# Altium schematic sheet hdmi.SchDoc
size A4
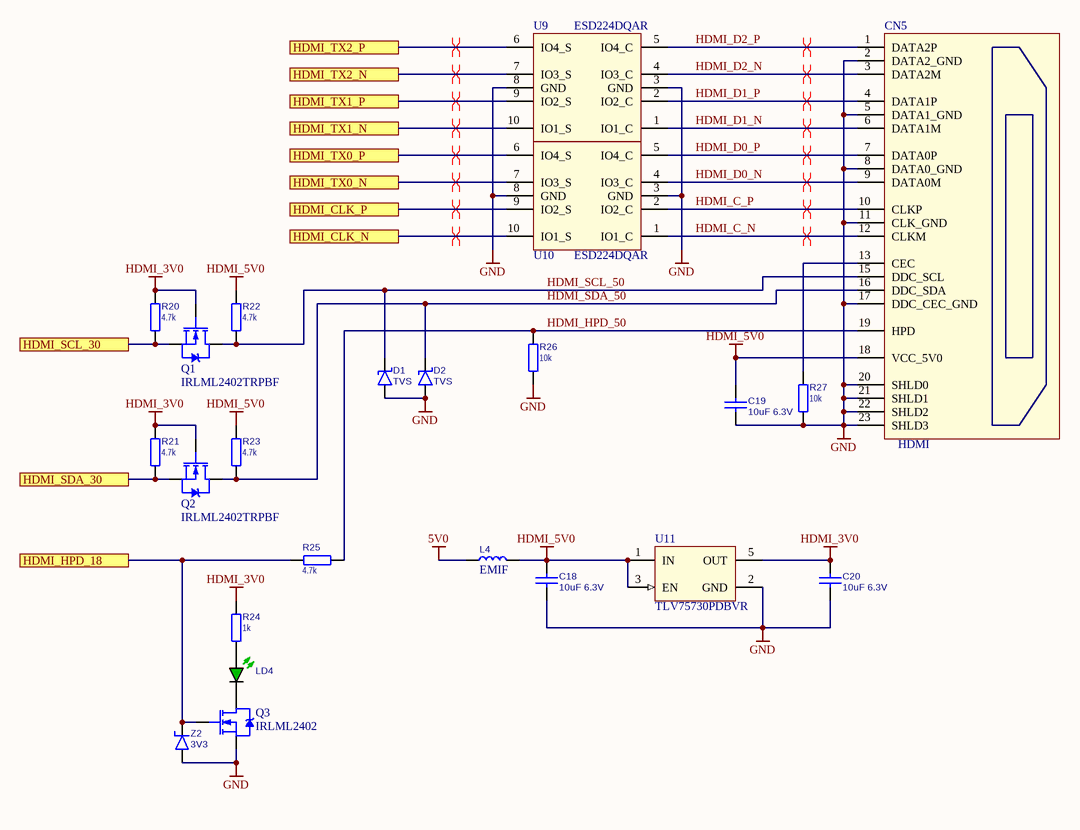
[diagram p0: hdmi.SchDoc]

## Parts
C18  value 10uF 6.3V  [C0603]  (hidden comment: CC0603MRX5R5BB106)
C19  value 10uF 6.3V  [C0603]  (hidden comment: CC0603MRX5R5BB106)
C20  value 10uF 6.3V  [C0603]  (hidden comment: CC0603MRX5R5BB106)
CN5  value HDMI  [1747981-1]  (hidden comment: KLS1-285-19-22-N1B)
D1  value TVS  [SOD-323]  (hidden comment: CDSOD323-T05LC)
D2  value TVS  [SOD-323]  (hidden comment: CDSOD323-T05LC)
L4  value EMIF  [IND0805]  (hidden comment: BLM21PG221SN1D)
LD4  LED_G  [LED0805]  (value not drawn)
Q1  IRLML2402TRPBF  [SOT-23-3]
Q2  IRLML2402TRPBF  [SOT-23-3]
Q3  IRLML2402  [SOT-23-3]
R20  4.7k  [R0603]
R21  4.7k  [R0603]
R22  4.7k  [R0603]
R23  4.7k  [R0603]
R24  1k  [R0603]
R25  4.7k  [R0603]
R26  10k  [R0603]
R27  10k  [R0603]
U9  ESD224DQAR  [USON-10]
U10  ESD224DQAR  [USON-10]
U11  TLV75730PDBVR  [SOT-23-5]
Z2  value 3V3  [SOD-80C]  (hidden comment: BZV55-C3V3.115)

## Ports
HDMI_CLK_N, HDMI_CLK_P, HDMI_HPD_18, HDMI_SCL_30, HDMI_SDA_30, HDMI_TX0_N, HDMI_TX0_P, HDMI_TX1_N, HDMI_TX1_P, HDMI_TX2_N, HDMI_TX2_P

## Nets
5V0: L4.2
GND: C18.2 C19.2 C20.2 CN5.2(DATA2_GND) CN5.5(DATA1_GND) CN5.8(DATA0_GND) CN5.11(CLK_GND) CN5.17(DDC_CEC_GND) CN5.20(SHLD0) CN5.21(SHLD1) CN5.22(SHLD2) CN5.23(SHLD3) D1.1(A) D2.1(A) Q3.2(S) R26.1 R27.1 U9.3(GND) U9.8(GND) U10.3(GND) U10.8(GND) U11.2(GND) Z2.1(A)
HDMI_3V0: C20.1 Q1.1(G) Q2.1(G) R20.2 R21.2 R24.2 U11.5(OUT)
HDMI_5V0: C18.1 C19.1 CN5.18(VCC_5V0) L4.1 R22.2 R23.2 U11.1(IN) U11.3(EN)
HDMI_C_N: CN5.12(CLKM) U10.1(IO1_C)
HDMI_C_P: CN5.10(CLKP) U10.2(IO2_C)
HDMI_CLK_N: U10.10(IO1_S) ; port HDMI_CLK_N
HDMI_CLK_P: U10.9(IO2_S) ; port HDMI_CLK_P
HDMI_D0_N: CN5.9(DATA0M) U10.4(IO3_C)
HDMI_D0_P: CN5.7(DATA0P) U10.5(IO4_C)
HDMI_D1_N: CN5.6(DATA1M) U9.1(IO1_C)
HDMI_D1_P: CN5.4(DATA1P) U9.2(IO2_C)
HDMI_D2_N: CN5.3(DATA2M) U9.4(IO3_C)
HDMI_D2_P: CN5.1(DATA2P) U9.5(IO4_C)
HDMI_HPD_18: Q3.1(G) R25.1 Z2.2(K) ; port HDMI_HPD_18
HDMI_HPD_50: CN5.19(HPD) R25.2 R26.2
HDMI_SCL_30: Q1.2(S) R20.1 ; port HDMI_SCL_30
HDMI_SCL_50: CN5.15(DDC_SCL) D1.2(K) Q1.3(D) R22.1
HDMI_SDA_30: Q2.2(S) R21.1 ; port HDMI_SDA_30
HDMI_SDA_50: CN5.16(DDC_SDA) D2.2(K) Q2.3(D) R23.1
HDMI_TX0_N: U10.7(IO3_S) ; port HDMI_TX0_N
HDMI_TX0_P: U10.6(IO4_S) ; port HDMI_TX0_P
HDMI_TX1_N: U9.10(IO1_S) ; port HDMI_TX1_N
HDMI_TX1_P: U9.9(IO2_S) ; port HDMI_TX1_P
HDMI_TX2_N: U9.7(IO3_S) ; port HDMI_TX2_N
HDMI_TX2_P: U9.6(IO4_S) ; port HDMI_TX2_P
NetCN5_13: CN5.13(CEC) R27.2
NetLD4_1: LD4.1 Q3.3(D)
NetLD4_2: LD4.2 R24.1

## Layout directives
differential pair: HDMI_C_N, HDMI_C_P, HDMI_CLK_N, HDMI_CLK_P, HDMI_D0_N, HDMI_D0_P, HDMI_D1_N, HDMI_D1_P, HDMI_D2_N, HDMI_D2_P, HDMI_TX0_N, HDMI_TX0_P, HDMI_TX1_N, HDMI_TX1_P, HDMI_TX2_N, HDMI_TX2_P

## Library data of the parts
C18-C20 = CAP_NPOL
CN5 = HDMI
D1 D2 = SHOTTKY
L4 = IND_WO_IRON
LD4 = LED_GREEN: LED Green; Value: *
Q1-Q3 = N-Channel: HEXFET Power MOSFET
  Q1: Value: IRLML2402
R20-R27 = RESISTOR: RES
  R20-R23 R25: Value: 4.7k
  R24: Value: 1k
  R26 R27: Value: 10k
U9 U10 = ESD224: ESD224 Low Clamping 4-Channel ESD Protection Device for HDMI Interface; value: ESD224
U11 = TLV733P: Capacitor-Free, 300-mA, Low-Dropout Regulator with Foldback Current Limit for Portable Devices; value: TLV733P
Z2 = ZENNER_1: ZENNER